# Altium schematic sheet main.SchDoc: COBAND
size A4; ENG_APP_DATE: --/--/--; DSN_APP_DATE: --/--/--; CHK_APP_DATE: --/--/--; CompanyName: MUISE; Engineer: Manuel Viqueira Rodríguez; Organization: ETSI Telecomunicaciones; Address1: Av. Complutense, 30; Address2: , 28040 Madrid; Address3: Madrid; Address4: España; DocumentNumber: 1; Revision: V1.0; SheetNumber: 1; SheetTotal: 8; Engineer2: Marcos Vázquez Núñez
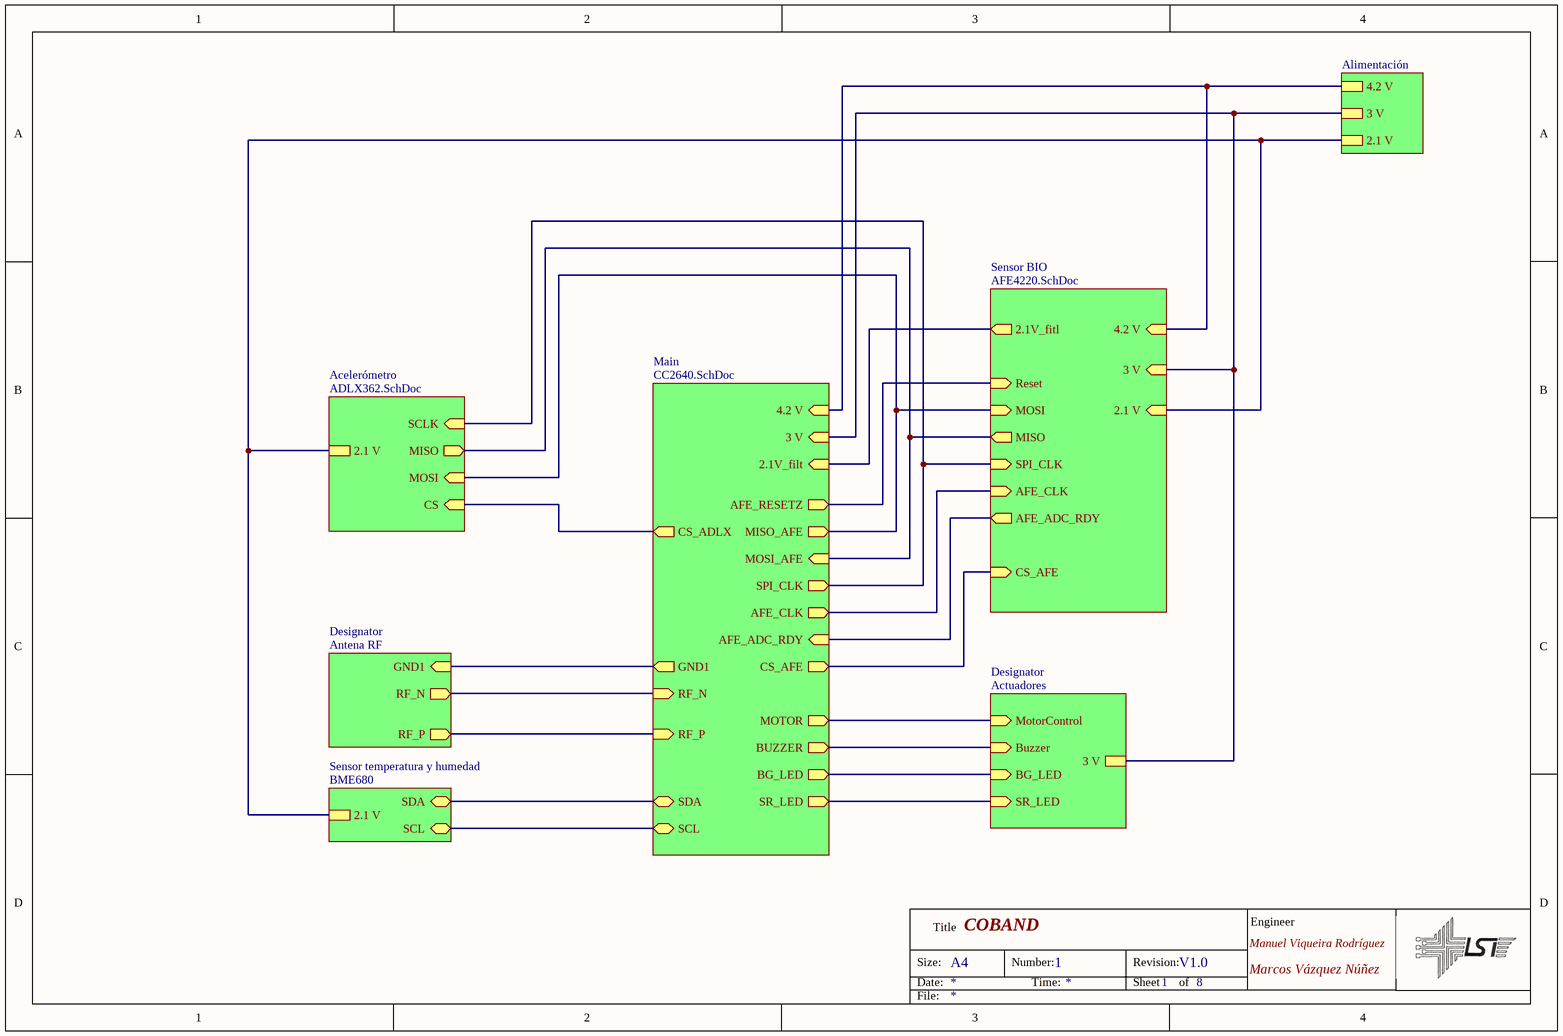
[diagram p0: main.SchDoc]

## Sub-sheets
Acelerómetro = ADLX362.SchDoc: MISO (out), MOSI (in), SCLK (in), CS (in), 2.1 V
Designator = Antena RF: RF_N (out), RF_P (out), GND1 (in)
Designator = Actuadores: MotorControl (in), Buzzer (in), BG_LED (in), SR_LED (in), 3 V
Main = CC2640.SchDoc: MOSI_AFE (in), AFE_RESETZ (out), MISO_AFE (out), SPI_CLK (out), AFE_ADC_RDY (in), BG_LED (out), SR_LED (out), MOTOR (out), BUZZER (out), CS_ADLX (out), RF_N (in), RF_P (in), SDA (bidir), SCL (bidir), AFE_CLK (out), CS_AFE (out), 2.1V_filt (in), 3 V (in), 4.2 V (in), GND1 (out)
Sensor BIO = AFE4220.SchDoc: Reset (in), SPI_CLK (in), MOSI (in), CS_AFE (in), AFE_CLK (in), MISO (out), AFE_ADC_RDY (out), 4.2 V (in), 3 V (in), 2.1 V (in), 2.1V_fitl (out)
Sensor temperatura y humedad = BME680: SDA (bidir), SCL (bidir), 2.1 V
? = Alimentación: 4.2 V, 3 V, 2.1 V

## Nets
(unnamed): sheet Main/MOSI_AFE, sheet Acelerómetro/MISO, sheet Sensor BIO/MISO
(unnamed): sheet Main/AFE_RESETZ, sheet Sensor BIO/Reset
(unnamed): sheet Main/MISO_AFE, sheet Acelerómetro/MOSI, sheet Sensor BIO/MOSI
(unnamed): sheet Main/SPI_CLK, sheet Acelerómetro/SCLK, sheet Sensor BIO/SPI_CLK
(unnamed): sheet Main/AFE_ADC_RDY, sheet Sensor BIO/AFE_ADC_RDY
(unnamed): sheet Main/BG_LED, sheet Designator/BG_LED
(unnamed): sheet Main/SR_LED, sheet Designator/SR_LED
(unnamed): sheet Main/MOTOR, sheet Designator/MotorControl
(unnamed): sheet Main/BUZZER, sheet Designator/Buzzer
(unnamed): sheet Main/CS_ADLX, sheet Acelerómetro/CS
(unnamed): sheet Main/RF_N, sheet Designator/RF_N
(unnamed): sheet Main/RF_P, sheet Designator/RF_P
(unnamed): sheet Main/SDA, sheet Sensor temperatura y humedad/SDA
(unnamed): sheet Main/SCL, sheet Sensor temperatura y humedad/SCL
(unnamed): sheet Main/AFE_CLK, sheet Sensor BIO/AFE_CLK
(unnamed): sheet Main/CS_AFE, sheet Sensor BIO/CS_AFE
(unnamed): sheet Main/2.1V_filt, sheet Sensor BIO/2.1V_fitl
(unnamed): sheet Main/3 V, sheet /3 V, sheet Designator/3 V, sheet Sensor BIO/3 V
(unnamed): sheet Main/4.2 V, sheet /4.2 V, sheet Sensor BIO/4.2 V
(unnamed): sheet Main/GND1, sheet Designator/GND1
(unnamed): sheet /2.1 V, sheet Acelerómetro/2.1 V, sheet Sensor temperatura y humedad/2.1 V, sheet Sensor BIO/2.1 V

## Notes on the sheet
- Size:
- Date:
- Title
- A4
- Number:
- Time:
- Revision:
- Sheet
- of
- Engineer
- File: